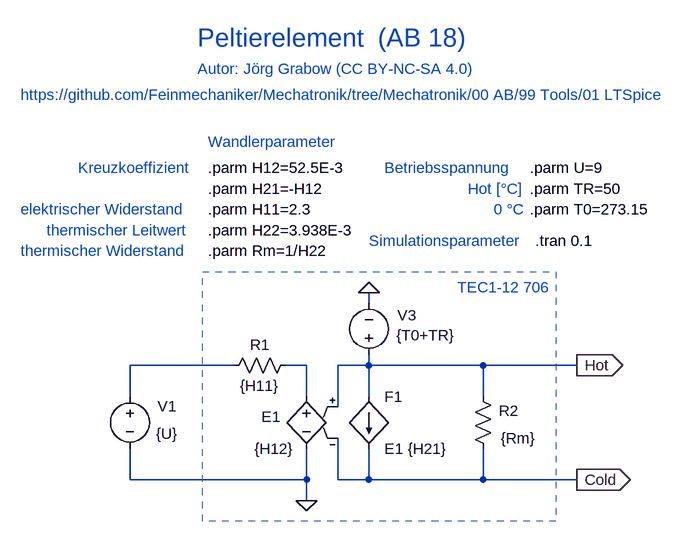
[diagram p0: schematic LAB_18.asc]
LAB_18.asc, the LTspice schematic file:
Version 4
SHEET 1 880 680
WIRE -2112 -656 -2112 -672
WIRE -2320 -560 -2480 -560
WIRE -2208 -560 -2240 -560
WIRE -2112 -560 -2112 -576
WIRE -2112 -560 -2160 -560
WIRE -1936 -560 -2112 -560
WIRE -1792 -560 -1936 -560
WIRE -2480 -512 -2480 -560
WIRE -2208 -512 -2208 -560
WIRE -2112 -512 -2112 -560
WIRE -1936 -512 -1936 -560
WIRE -2160 -496 -2160 -560
WIRE -2480 -384 -2480 -432
WIRE -2208 -384 -2208 -432
WIRE -2208 -384 -2480 -384
WIRE -2160 -384 -2160 -448
WIRE -2112 -384 -2112 -432
WIRE -2112 -384 -2160 -384
WIRE -1936 -384 -1936 -432
WIRE -1936 -384 -2112 -384
WIRE -1792 -384 -1936 -384
WIRE -2208 -352 -2208 -384
FLAG -2208 -352 0
FLAG -2112 -672 0
FLAG -1792 -384 Cold
IOPIN -1792 -384 Out
FLAG -1792 -560 Hot
IOPIN -1792 -560 Out
SYMBOL res -2336 -544 R270
WINDOW 0 32 56 VTop 2
WINDOW 3 0 56 VBottom 2
SYMATTR InstName R1
SYMATTR Value {H11}
SYMBOL res -1952 -528 R0
WINDOW 0 40 38 Left 2
WINDOW 3 43 80 Left 2
SYMATTR InstName R2
SYMATTR Value {Rm}
SYMBOL voltage -2480 -528 R0
WINDOW 39 -126 38 Left 2
WINDOW 0 43 31 Left 2
WINDOW 3 40 73 Left 2
SYMATTR Value2 AC 0 0
SYMATTR InstName V1
SYMATTR Value {U}
SYMBOL f -2112 -512 R0
SYMATTR Value E1 {H21}
SYMATTR InstName F1
SYMBOL e -2208 -528 M0
WINDOW 0 40 47 Left 2
WINDOW 3 19 96 Left 2
SYMATTR InstName E1
SYMATTR Value {H12}
SYMBOL voltage -2112 -560 R180
WINDOW 123 0 0 Left 0
WINDOW 39 0 0 Left 0
WINDOW 0 -73 77 Left 2
WINDOW 3 -134 46 Left 2
SYMATTR InstName V3
SYMATTR Value {T0+TR}
TEXT -2360 -832 Left 2 !.parm H21=-H12
TEXT -2360 -864 Left 2 !.parm H12=52.5E-3
TEXT -2360 -800 Left 2 !.parm H11=2.3
TEXT -2360 -736 Left 2 !.parm Rm=1/H22
TEXT -2360 -768 Left 2 !.parm H22=3.938E-3
TEXT -2360 -904 Left 2 ;Wandlerparameter
TEXT -1856 -752 Left 2 !.tran 0.1
TEXT -2112 -752 Left 2 ;Simulationsparameter
TEXT -2648 -800 Left 2 ;elektrischer Widerstand
TEXT -2608 -768 Left 2 ;thermischer Leitwert
TEXT -2560 -864 Left 2 ;Kreuzkoeffizient
TEXT -2648 -736 Left 2 ;thermischer Widerstand
TEXT -1960 -832 Left 2 ;Hot [°C]
TEXT -1864 -832 Left 2 !.parm TR=50
TEXT -1864 -800 Left 2 !.parm T0=273.15
TEXT -2376 -1064 Left 4 ;Peltierelement  (AB 18)
TEXT -2648 -976 Left 2 ;https://github.com/Feinmechaniker/Mechatronik/tree/Mechatronik/00 AB/99 Tools/01 LTSpice
TEXT -2376 -1016 Left 2 ;Autor: Jörg Grabow (CC BY-NC-SA 4.0)
TEXT -1920 -800 Left 2 ;0 °C
TEXT -2088 -864 Left 2 ;Betriebsspannung
TEXT -1864 -864 Left 2 !.parm U=9
TEXT -1976 -680 Left 2 ;TEC1-12 706
RECTANGLE Normal -1824 -320 -2368 -704 2

The netlist it stands for:
* LAB_18.asc
R1 N001 N002 {H11}
R2 Hot Cold {Rm}
V1 N001 0 {U} AC 0 0
F1 Hot Cold E1 {H21}
E1 N002 0 Hot Cold {H12}
V3 Hot 0 {T0+TR}
.parm H21=-H12
.parm H12=52.5E-3
.parm H11=2.3
.parm Rm=1/H22
.parm H22=3.938E-3
* Wandlerparameter
.tran 0.1
* Simulationsparameter
* elektrischer Widerstand
* thermischer Leitwert
* Kreuzkoeffizient
* thermischer Widerstand
* Hot [°C]
.parm TR=50
.parm T0=273.15
* Peltierelement  (AB 18)
* https://github.com/Feinmechaniker/Mechatronik/tree/Mechatronik/00 AB/99 Tools/01 LTSpice
* Autor: Jörg Grabow (CC BY-NC-SA 4.0)
* 0 °C
* Betriebsspannung
.parm U=9
* TEC1-12 706
.backanno
.end